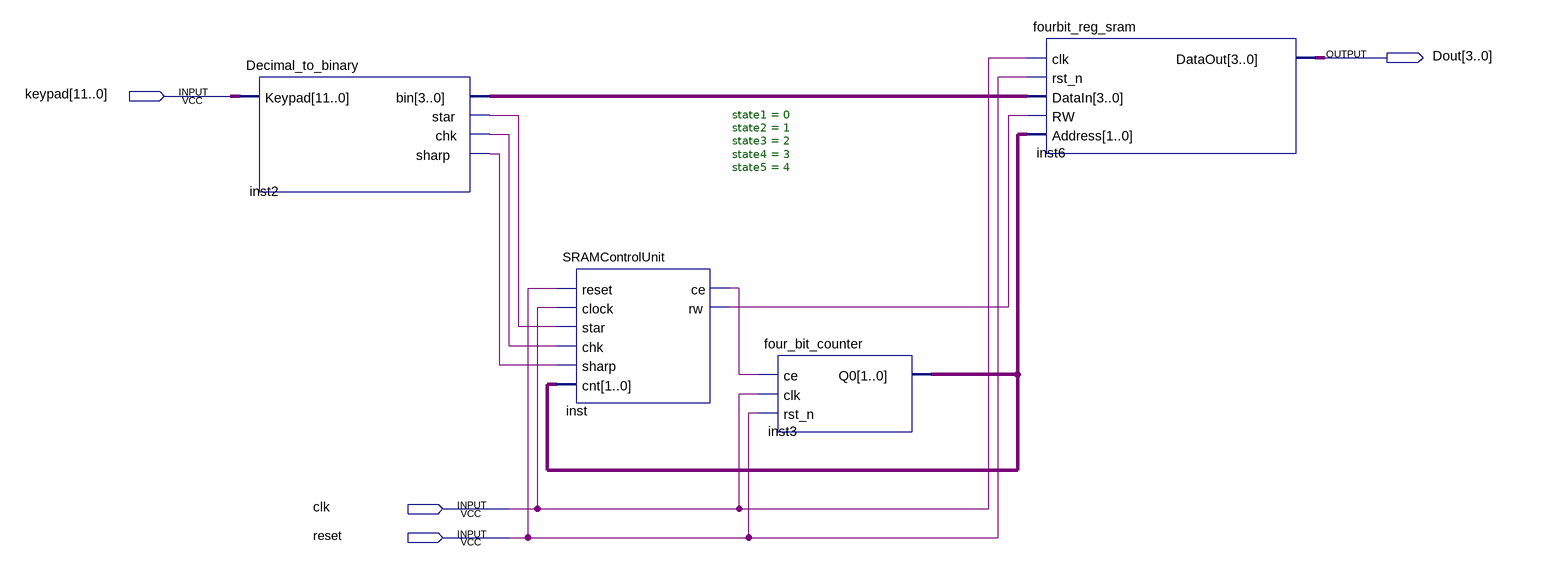
[diagram p0: schematic sheet]
// Quartus schematic KeypadShiftRegister.bdf as structural Verilog: 4 symbols, 4 pins
module KeypadShiftRegister (
  input  [11:0] keypad,
  input  clk,
  input  reset,
  output [3:0] Dout
);

  wire inst2_chk, inst2_sharp, inst2_star, inst_ce, inst_rw;
  wire [1:0] inst3_q0;
  wire [3:0] inst2_bin;

  Decimal_to_binary inst2 (.Keypad(keypad), .bin(inst2_bin), .star(inst2_star), .chk(inst2_chk), .sharp(inst2_sharp));
  SRAMControlUnit #(.state1(0), .state2(1), .state3(2), .state4(3), .state5(4)) inst (
    .reset(reset), .clock(clk), .star(inst2_star), .chk(inst2_chk), .sharp(inst2_sharp), .cnt(inst3_q0),
    .ce(inst_ce), .rw(inst_rw));
  four_bit_counter inst3 (.ce(inst_ce), .clk(clk), .rst_n(reset), .Q0(inst3_q0));
  fourbit_reg_sram inst6 (
    .clk(clk), .rst_n(reset), .DataIn(inst2_bin), .RW(inst_rw), .Address(inst3_q0), .DataOut(Dout));
endmodule
